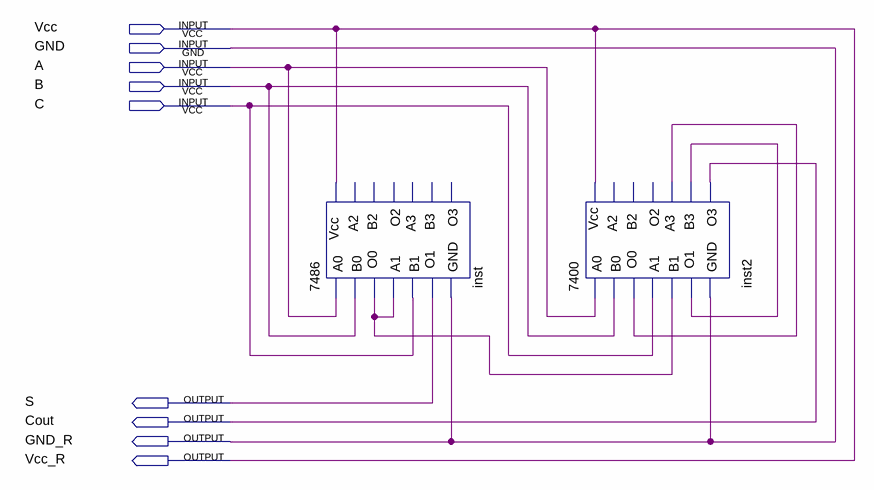
[diagram p0: schematic sheet]
// Quartus schematic Circuit_2.bdf as structural Verilog: 2 symbols, 9 pins
module Circuit_2 (
  input  Vcc,
  input  GND,
  input  A,
  input  B,
  input  C,
  output S,
  output Cout,
  output GND_R,
  output Vcc_R
);

  wire inst2_o0, inst2_o1, inst_o0;

  \7486  inst (
    .Vcc(Vcc), .A0(A), .B0(B), .A1(inst_o0), .B1(C), .GND(GND), .O0(inst_o0), .O1(S));  // open: A2, B2, A3, B3, O2, O3
  \7400  inst2 (
    .Vcc(Vcc), .A0(A), .B0(B), .A1(C), .B1(inst_o0), .A3(inst2_o0), .B3(inst2_o1), .GND(GND), .O0(inst2_o0),
    .O1(inst2_o1), .O3(Cout));  // open: A2, B2, O2

  assign GND_R = GND;
  assign Vcc_R = Vcc;
endmodule
